# Altium schematic sheet Arduino_Connector.SchDoc: Arduino Connector
size A4; CompanyName: STMicroelectronics; Organization: Microcontrollers Division; DocumentNumber: 10; SheetNumber: 16; SheetTotal: 19
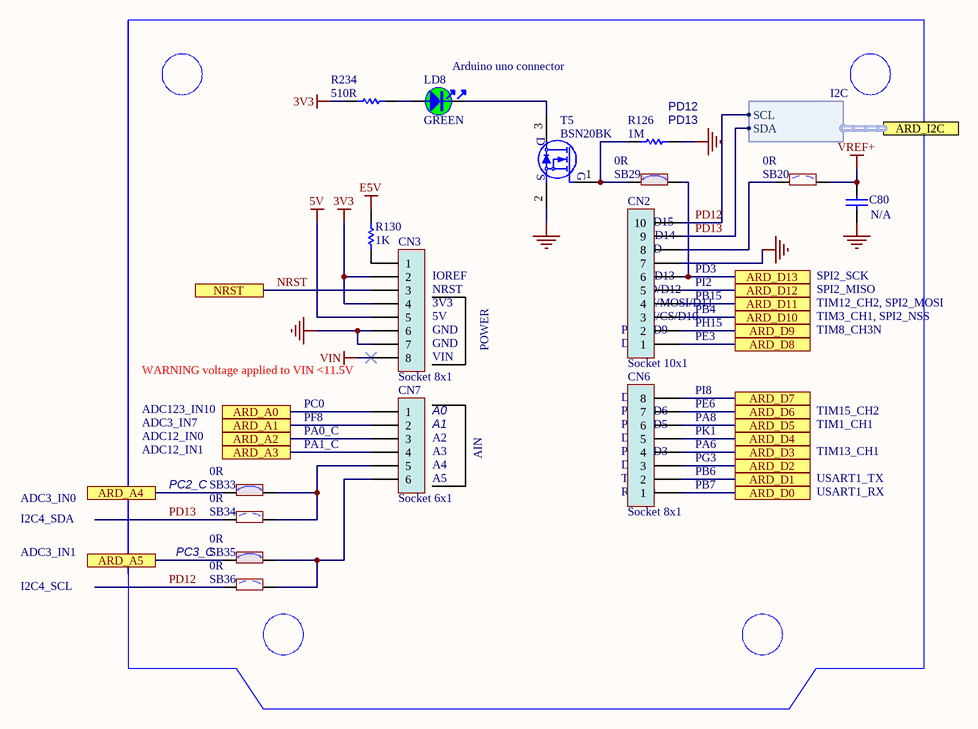
[diagram p0: Arduino_Connector.SchDoc]

## Parts
C80  N/A  [C0603]
CN2  Socket 10x1  [CON_SAMTEC_SSW-110-22-X-S-VS]
CN3  Socket 8x1  [CON_SAMTEC_SSW-108-22-X-S-VS]
CN6  Socket 8x1  [CON_SAMTEC_SSW-108-22-X-S-VS]
CN7  Socket 6x1  [CON_SAMTEC_SSW-106-22-X-S-VS]
LD8  value GREEN  [LED_0603_GREEN]  (hidden comment: LED_green)
R126  value 1M  [R0603]  (hidden comment: Resistor)
R130  value 1K  [R0603]  (hidden comment: Resistor)
R234  value 510R  [R0603]  (hidden comment: Resistor)
SB20  value 0R  [SOLDER-BRIDGE_R0603-0R]  (hidden comment: SB_OFF)
SB29  value 0R  [SOLDER-BRIDGE_R0603-0R]  (hidden comment: SB_ON)
SB33  value 0R  [SOLDER-BRIDGE_R0603-0R]  (hidden comment: SB_ON)
SB34  value 0R  [SOLDER-BRIDGE_R0603-0R]  (hidden comment: SB_OFF)
SB35  value 0R  [SOLDER-BRIDGE_R0603-0R]  (hidden comment: SB_ON)
SB36  value 0R  [SOLDER-BRIDGE_R0603-0R]  (hidden comment: SB_OFF)
T5  value BSN20BK  [MOS_SOT23]  (hidden comment: BSN20)

## Ports
ARD_A0, ARD_A1, ARD_A2, ARD_A3, ARD_A4, ARD_A5, ARD_D0, ARD_D1, ARD_D2, ARD_D3, ARD_D4, ARD_D5, ARD_D6, ARD_D7, ARD_D8, ARD_D9, ARD_D10, ARD_D11, ARD_D12, ARD_D13, ARD_I2C (harness I2C), NRST

## Harnesses
I2C: SDA, SCL

## Nets
3V3: CN3.2 CN3.4 R234.2
5V: CN3.5
E5V: R130.1
GND: C80.1 CN2.7 CN3.6 CN3.7 R126.2 T5.2(S)
VIN: CN3.8
VREF+: C80.2 SB20.2
ARD_A0: CN7.1 ; port ARD_A0
ARD_A1: CN7.2 ; port ARD_A1
ARD_A2: CN7.3 ; port ARD_A2
ARD_A3: CN7.4 ; port ARD_A3
ARD_A4: SB33.1 ; port ARD_A4
ARD_A5: SB35.1 ; port ARD_A5
ARD_D0: CN6.1 ; port ARD_D0
ARD_D1: CN6.2 ; port ARD_D1
ARD_D2: CN6.3 ; port ARD_D2
ARD_D3: CN6.4 ; port ARD_D3
ARD_D4: CN6.5 ; port ARD_D4
ARD_D5: CN6.6 ; port ARD_D5
ARD_D6: CN6.7 ; port ARD_D6
ARD_D7: CN6.8 ; port ARD_D7
ARD_D8: CN2.1 ; port ARD_D8
ARD_D9: CN2.2 ; port ARD_D9
ARD_D10: CN2.3 ; port ARD_D10
ARD_D11: CN2.4 ; port ARD_D11
ARD_D12: CN2.5 ; port ARD_D12
ARD_D13: CN2.6 SB29.2 ; port ARD_D13
NRST: CN3.3 ; port NRST
PD12: CN2.10 SB36.1 ; port ARD_I2C.SCL
PD13: CN2.9 SB34.1 ; port ARD_I2C.SDA
NetCN2_8: CN2.8 SB20.1
NetCN3_1: CN3.1 R130.2
NetCN7_5: CN7.5 SB33.2 SB34.2
NetCN7_6: CN7.6 SB35.2 SB36.2
NetLD8_1: LD8.1 R234.1
NetLD8_2: LD8.2 T5.3(D)
NetR126_1: R126.1 SB29.1 T5.1(G)

## Notes on the sheet
- (near LD8) Arduino uno connector
- (near R126) PD12
- (near R126) PD13
- (near CN2) SDA/D14
- SCL/D15
- (near CN2) AVDD
- (near CN2) GND
- (near CN3) IOREF
- (near CN3) NRST
- (near CN3) 3V3
- (near CN3) 5V
- (near CN2) PWM/CS/D10
- (near CN2) SCK/D13
- (near CN2) MISO/D12
- (near CN2) PWM/MOSI/D11
- (near CN2) PB4
- (near CN2) PH15
- (near CN2) PB15
- (near CN2) PI2
- (near CN2) PD3
- TIM3_CH1, SPI2_NSS
- TIM12_CH2, SPI2_MOSI
- SPI2_MISO
- SPI2_SCK
- WARNING voltage applied to VIN <11.5V
- (near CN3) GND
- (near CN3) VIN
- POWER
- (near CN6) D7
- (near CN2) D8
- (near CN2) PWM/D9
- PI8
- (near CN2) PE3
- TIM8_CH3N
- ADC12_IN1
- ADC12_IN0
- ADC3_IN7
- ADC123_IN10
- PC0
- PF8
- PA0_C
- PA1_C
- (near CN7) A0
- (near CN7) A1
- (near CN7) A2
- (near CN7) A3
- AIN
- (near CN6) D4
- (near CN6) PWM/D3
- (near CN6) PWM/D5
- (near CN6) PWM/D6
- (near CN6) PG3
- (near CN6) PK1
- (near CN6) PA8
- (near CN6) PE6
- (near CN6) PA6
- TIM1_CH1
- TIM13_CH1
- TIM15_CH2
- ADC3_IN0
- I2C4_SDA
- PC2_C
- (near CN7) A4
- (near CN7) A5
- (near CN6) RX/D0
- (near CN6) TX/D1
- (near CN6) D2
- (near CN6) PB6
- (near CN6) PB7
- USART1_RX
- USART1_TX
- ADC3_IN1
- I2C4_SCL
- PC3_C
- Title:
- Project:
- Size:
- Revision:
- Variant:
- -
- Date:
- Reference:
- Sheet:
- of

## Library data of the parts
C80 = MCD-00211: Capacitor, MLCC, 100nF, 16V, X7R, 10%, 0603, T=0,8mm; Manufacturer_Part_Number: CC0603KRX7R7BB104; Manufacturer: YAGEO; Part_Preference: Recommended; Partial_Alternate_Internal_Part_Number: MCD-01099; Provided_By: Subcon; Initial_Board_Reference: mb1319; Component_Country_Of_Origin: China; ID: 2659; Order_Code_RS: 669-8763; ShowFields: YES; Internal_Part_Number: MCD-00211; Value: 100nF; Status: Released; Part_Type: Capacitor; Package: 0603; ComponentLink1Description: Yageo_Capacitor_X7R-series.pdf; ComponentLink1URL: http://tunmcdsvn.tun.st.com/Component_Documentation_Library/Trunk/Capacitor/YAGEO_X7R_Series; ECCN_US: n/a; ECCN_EU: n/a; Order_Code_Digikey: 311-1088-1-ND; Order_Code_Farnell: 432210
CN2 = MCD-00301: Socket, 10x1, 2.54mm, VR, SMT, Height 9.78mm; Manufacturer_Part_Number: SSW-110-22-L-S-VS; Manufacturer: SAMTEC; Part_Type: Connector; Part_Preference: Recommended; Provided_By: Subcon; Initial_Board_Reference: MB1272; Component_Country_Of_Origin: China, Costa Rica, Malaysia, USA, Vietnam; ID: 2566; ShowFields: YES; Internal_Part_Number: MCD-00301; Value: Socket 10x1; ECCN_US: n/a; ECCN_EU: n/a; ComponentLink1Description: SAMTEC_SSW_SMT.pdf; Status: Checked; ComponentLink1URL: http://tunmcdsvn.tun.st.com/Component_Documentation_Library/Trunk/Connector/SAMTEC_SSW-SSQ(SMD)_Series; Order_Code_Digikey: SSW-110-22-L-S-VS-ND; Order_Code_Farnell: N/A; Order_Code_RS: N/A
CN3 = MCD-00300: Socket, 8x1, 2.54mm, VR, SMT, Height 9.78mm; Manufacturer_Part_Number: SSW-108-22-L-S-VS; Manufacturer: SAMTEC; Part_Type: Connector; Part_Preference: Recommended; Provided_By: Subcon; Initial_Board_Reference: MB1272; Component_Country_Of_Origin: China, Costa Rica, Malaysia, USA, Vietnam; ID: 2571; ShowFields: YES; Internal_Part_Number: MCD-00300; Value: Socket 8x1; ECCN_US: n/a; ECCN_EU: n/a; ComponentLink1Description: SAMTEC_SSW_SMT.pdf; Status: Checked; ComponentLink1URL: http://tunmcdsvn.tun.st.com/Component_Documentation_Library/Trunk/Connector/SAMTEC_SSW-SSQ(SMD)_Series/; Order_Code_Digikey: SSW-108-22-L-S-VS-ND; Order_Code_Farnell: N/A; Order_Code_RS: N/A
CN6 = MCD-00300: Socket, 8x1, 2.54mm, VR, SMT, Height 9.78mm; Part_Type: Connector; Manufacturer_Part_Number: SSW-108-22-L-S-VS; Manufacturer: SAMTEC; Part_Preference: Recommended; Provided_By: Subcon; Initial_Board_Reference: MB1272; Component_Country_Of_Origin: China, Costa Rica, Malaysia, USA, Vietnam; ID: 2571; ShowFields: YES; Internal_Part_Number: MCD-00300; Value: Socket 8x1; Status: Checked; ComponentLink1Description: SAMTEC_SSW_SMT.pdf; ComponentLink1URL: http://tunmcdsvn.tun.st.com/Component_Documentation_Library/Trunk/Connector/SAMTEC_SSW-SSQ(SMD)_Series/; ECCN_US: n/a; ECCN_EU: n/a; Order_Code_Digikey: SSW-108-22-L-S-VS-ND; Order_Code_Farnell: N/A; Order_Code_RS: N/A
CN7 = MCD-00299: Socket, 6x1, 2.54mm, VR, SMT, Height 9.78mm; Part_Type: Connector; Manufacturer_Part_Number: SSW-106-22-L-S-VS; Manufacturer: SAMTEC; Part_Preference: Recommended; Provided_By: Subcon; Initial_Board_Reference: MB1272; Component_Country_Of_Origin: China, Costa Rica, Malaysia, USA, Vietnam; ID: 2569; ShowFields: YES; Internal_Part_Number: MCD-00299; Value: Socket 6x1; Status: Checked; ComponentLink1Description: SAMTEC_SSW_SMT.pdf; ComponentLink1URL: http://tunmcdsvn.tun.st.com/Component_Documentation_Library/Trunk/Connector/SAMTEC_SSW-SSQ(SMD)_Series/; ECCN_US: n/a; ECCN_EU: n/a; Order_Code_Digikey: SSW-106-22-L-S-VS-ND; Order_Code_Farnell: N/A; Order_Code_RS: N/A
LD8 = MCD-02900: LED, Green, 2V, 25mA, 0603, SMD; Part_Type: Display; Part_Preference: Recommended; Manufacturer: EVERLIGHT; Manufacturer_Part_Number: 19-213SYGC/S530-E2/5T; Full_Alternate_Internal_Part_Number: MCD-00320; Partial_Alternate_Internal_Part_Number: MCD-00050; Component_Country_Of_Origin: China; ShowFields: YES; ID: 5016; Internal_Part_Number: MCD-02900; Status: Checked; Package: 0603; ComponentLink1URL: http://tunmcdsvn.tun.st.com/Component_Documentation_Library/Trunk/Display/EVERLIGHT_19-213SYGC-S530-E2-5T; Order_Code_Digikey: 1080-19-213SYGC/S530-E2/5TTR-ND; Order_Code_Farnell: N/A; Order_Code_RS: N/A
R126 = MCD-00257: Resistor,1M,0603,1%,1/10W; Manufacturer_Part_Number: RC0603FR-071ML; Manufacturer: YAGEO; Part_Preference: Recommended; Provided_By: Subcon; Initial_Board_Reference: mb1319; Component_Country_Of_Origin: China; ID: 2612; ShowFields: YES; Internal_Part_Number: MCD-00257; Status: Released; Part_Type: Resistor; Package: 0603; ComponentLink1Description: Yageo_Resistor_RC0603-series.pdf; ComponentLink1URL: http://tunmcdsvn.tun.st.com/Component_Documentation_Library/Trunk/Resistor/YAGEO_RC_L_Series; ECCN_US: n/a; ECCN_EU: n/a; Order_Code_Digikey: 311-1.00MHRCT-ND; Order_Code_Farnell: 9238840; Order_Code_RS: N/A
R130 = MCD-00070: Resistor,1K,0603,1%,1/10W; Manufacturer_Part_Number: RC0603FR-071KL; Manufacturer: YAGEO; Part_Preference: Recommended; Provided_By: Subcon; Initial_Board_Reference: mb1274; Component_Country_Of_Origin: China; ID: 2522; Order_Code_RS: 9238484RL; ShowFields: YES; Internal_Part_Number: MCD-00070; Status: Released; Part_Type: Resistor; Package: 0603; ComponentLink1Description: Yageo_Resistor_RC0603-series.pdf; ComponentLink1URL: http://tunmcdsvn.tun.st.com/Component_Documentation_Library/Trunk/Resistor/YAGEO_RC_L_Series; ECCN_US: n/a; ECCN_EU: n/a; Order_Code_Digikey: 311-1.00KHRCT-ND; Order_Code_Farnell: 9238484RL
R234 = MCD-00225: Resistor,510R,0603,1%,1/10W; Manufacturer_Part_Number: RC0603FR-07510RL; Manufacturer: YAGEO; Part_Preference: Recommended; Provided_By: Subcon; Initial_Board_Reference: mb1319; Component_Country_Of_Origin: China; ID: 2644; ShowFields: YES; Internal_Part_Number: MCD-00225; ECCN_US: n/a; ECCN_EU: n/a; ComponentLink1Description: Yageo_Resistor_RC0603-series.pdf; Status: Released; Part_Type: Resistor; Package: 0603; ComponentLink1URL: http://tunmcdsvn.tun.st.com/Component_Documentation_Library/Trunk/Resistor/YAGEO_RC_L_Series; Order_Code_Digikey: 311-510HRCT-ND; Order_Code_Farnell: 1799351; Order_Code_RS: N/A
SB20 SB34 SB36 = MCD-00072: Solder Bridge OFF; Part_Type: Resistor; Manufacturer: YAGEO; Manufacturer_HQ_COO: Unknown; Manufacturer_Part_Number: RC0603JR-070RL; Part_Preference: Recommended; Initial_Board_Reference: mb1274; Component_Country_Of_Origin: China; ID: 2520; Order_Code_RS: 199-5647; ShowFields: YES; Internal_Part_Number: MCD-00072; Status: Released; ECCN_US: n/a; ECCN_EU: n/a; Provided_By: n/a; ComponentLink1URL: http://tunmcdsvn.tun.st.com/Component_Documentation_Library/Trunk/Resistor/YAGEO_RC_Series; Order_Code_Digikey: 311-0.0GRTR-ND; Order_Code_Farnell: 2421846; Package: 0603
SB29 SB33 SB35 = MCD-00071: Solder Bridge ON; Part_Type: Resistor; Manufacturer: YAGEO; Manufacturer_HQ_COO: Unknown; Manufacturer_Part_Number: RC0603JR-070RL; Part_Preference: Recommended; Provided_By: Subcon; Initial_Board_Reference: mb1274; Component_Country_Of_Origin: China; ID: 2521; Order_Code_RS: 199-5647; ShowFields: YES; Internal_Part_Number: MCD-00071; ECCN_US: n/a; ECCN_EU: n/a; Status: Released; ComponentLink1URL: http://tunmcdsvn.tun.st.com/Component_Documentation_Library/Trunk/Resistor/YAGEO_RC_Series; Order_Code_Digikey: 311-0.0GRTR-ND; Order_Code_Farnell: 2421846; Package: 0603
T5 = MCD-01969: Transistor, N-channel enhancement mode field-effect transistor; Part_Preference: Recommended; Manufacturer: NEXPERIA; Order_Code_RS: 136-4845; Component_Country_Of_Origin: China; ShowFields: YES; ID: 4069; Internal_Part_Number: MCD-01969; Status: Released; Part_Type: Transistor; Manufacturer_Part_Number: BSN20BK; Package: SOT23-3; ComponentLink1URL: http://tunmcdsvn.tun.st.com/Component_Documentation_Library/Trunk/Transistor/NEXPERIA_BSN20BK; Order_Code_Digikey: 1727-2341-1-ND; Order_Code_Farnell: 2575103